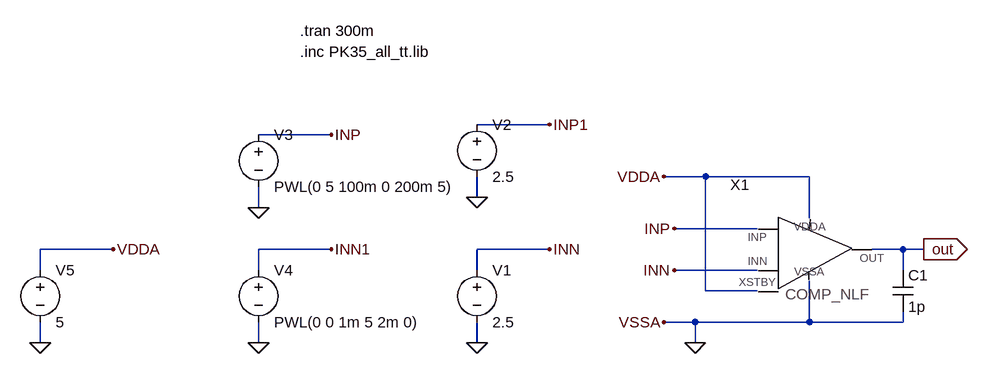
[diagram p0: schematic tb_COMP_NLF.asc]
tb_COMP_NLF.asc, the LTspice schematic file:
Version 4
SHEET 1 2652 3372
WIRE -688 1344 -800 1344
WIRE -1024 1360 -1136 1360
WIRE -448 1424 -512 1424
WIRE -288 1424 -448 1424
WIRE -800 1456 -800 1424
WIRE -1136 1472 -1136 1440
WIRE -288 1488 -288 1424
WIRE -368 1504 -496 1504
WIRE -1360 1536 -1472 1536
WIRE -1024 1536 -1136 1536
WIRE -688 1536 -800 1536
WIRE -144 1536 -192 1536
WIRE -112 1536 -144 1536
WIRE -1472 1568 -1472 1536
WIRE -1136 1568 -1136 1536
WIRE -800 1568 -800 1536
WIRE -368 1568 -496 1568
WIRE -144 1568 -144 1536
WIRE -448 1600 -448 1424
WIRE -368 1600 -448 1600
WIRE -464 1648 -512 1648
WIRE -288 1648 -288 1584
WIRE -288 1648 -464 1648
WIRE -144 1648 -144 1632
WIRE -144 1648 -288 1648
WIRE -1472 1680 -1472 1648
WIRE -1136 1680 -1136 1648
WIRE -800 1680 -800 1648
WIRE -464 1680 -464 1648
FLAG -800 1680 0
FLAG -800 1456 0
FLAG -688 1536 INN
FLAG -688 1344 INP1
FLAG -1136 1472 0
FLAG -1024 1360 INP
FLAG -1136 1680 0
FLAG -1024 1536 INN1
FLAG -1472 1680 0
FLAG -1360 1536 VDDA
FLAG -112 1536 out
IOPIN -112 1536 Out
FLAG -512 1424 VDDA
FLAG -512 1648 VSSA
FLAG -496 1504 INP
FLAG -496 1568 INN
FLAG -464 1680 0
SYMBOL voltage -800 1552 R0
WINDOW 123 0 0 Left 0
WINDOW 39 0 0 Left 0
SYMATTR InstName V1
SYMATTR Value 2.5
SYMBOL voltage -800 1328 R0
WINDOW 123 24 124 Left 2
WINDOW 39 0 0 Left 0
SYMATTR InstName V2
SYMATTR Value 2.5
SYMBOL voltage -1136 1344 R0
WINDOW 123 0 0 Left 0
WINDOW 39 0 0 Left 0
SYMATTR InstName V3
SYMATTR Value PWL(0 5 100m 0 200m 5)
SYMBOL voltage -1136 1552 R0
WINDOW 123 0 0 Left 0
WINDOW 39 0 0 Left 0
SYMATTR InstName V4
SYMATTR Value PWL(0 0 1m 5 2m 0)
SYMBOL voltage -1472 1552 R0
WINDOW 123 0 0 Left 0
WINDOW 39 0 0 Left 0
SYMATTR InstName V5
SYMATTR Value 5
SYMBOL COMP_NLF -336 1536 R0
SYMATTR InstName X1
SYMBOL cap -160 1568 R0
SYMATTR InstName C1
SYMATTR Value 1p
TEXT -1072 1232 Left 2 !.inc PK35_all_tt.lib
TEXT -1072 1200 Left 2 !.tran 300m

The netlist it stands for:
* tb_COMP_NLF.asc
V1 INN 0 2.5
V2 INP1 0 2.5
V3 INP 0 PWL(0 5 100m 0 200m 5)
V4 INN1 0 PWL(0 0 1m 5 2m 0)
V5 VDDA 0 5
XX1 INP INN VDDA out VDDA 0 COMP_NLF  ; pins INP INN XSTBY OUT VDDA VSSA
C1 out 0 1p
.inc PK35_all_tt.lib
.tran 300m
.backanno
.end